# Altium schematic sheet Power_Embedded_Board_Top.SchDoc
size A; SheetNumber: 1; SheetTotal: 9
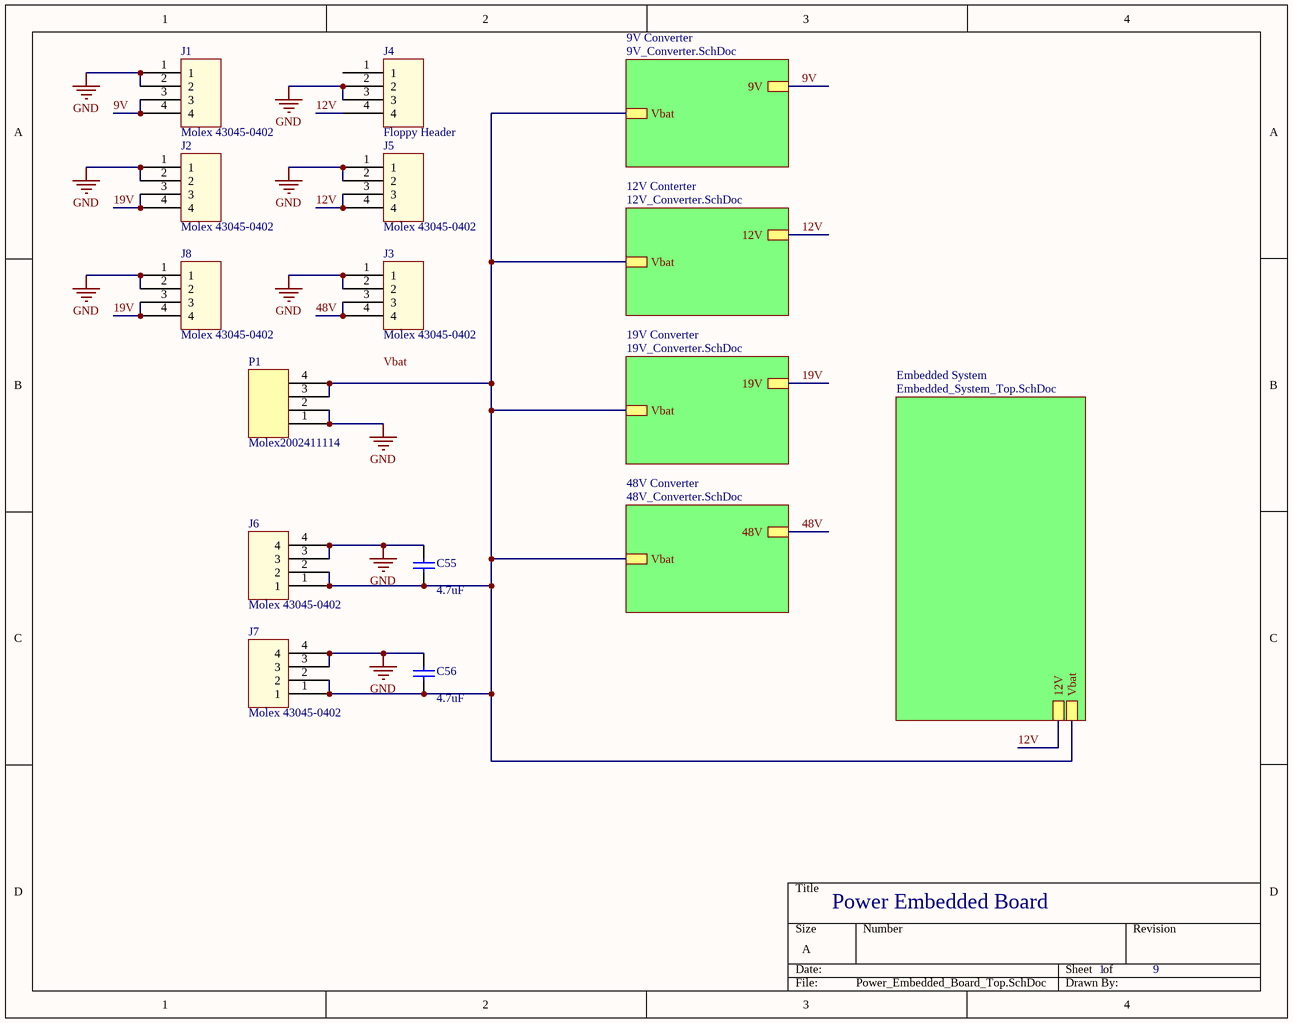
[diagram p0: Power_Embedded_Board_Top.SchDoc]

## Parts
C55  value 4.7uF  [C1210]  (hidden comment: HMK325C7475KN-TE)
C56  value 4.7uF  [C1210]  (hidden comment: HMK325C7475KN-TE)
J1  Molex 43045-0402  [Molex43045-0402]
J2  Molex 43045-0402  [Molex43045-0402]
J3  Molex 43045-0402  [Molex43045-0402]
J4  Floppy Header  [Header 1x4 12V]
J5  Molex 43045-0402  [Molex43045-0402]
J6  Molex 43045-0402  [Molex43045-0402]
J7  Molex 43045-0402  [Molex43045-0402]
J8  Molex 43045-0402  [Molex43045-0402]
P1  Molex2002411114  [Molex2002411114]

## Sub-sheets
9V Converter = 9V_Converter.SchDoc: Vbat, 9V
12V Conterter = 12V_Converter.SchDoc: Vbat, 12V
19V Converter = 19V_Converter.SchDoc: Vbat, 19V
48V Converter = 48V_Converter.SchDoc: Vbat, 48V
Embedded System = Embedded_System_Top.SchDoc: Vbat, 12V

## Nets
GND: C55.2 C56.2 J1.1 J1.2 J2.1 J2.2 J3.1 J3.2 J4.2 J4.3 J5.1 J5.2 J6.3 J6.4 J7.3 J7.4 J8.1 J8.2 P1.1 P1.2
9V: J1.3 J1.4 ; sheet 9V Converter/9V
12V: J4.4 J5.3 J5.4 ; sheet 12V Conterter/12V, sheet Embedded System/12V
19V: J2.3 J2.4 J8.3 J8.4 ; sheet 19V Converter/19V
48V: J3.3 J3.4 ; sheet 48V Converter/48V
NetC55_1: C55.1 C56.1 J6.1 J6.2 J7.1 J7.2 P1.3 P1.4 ; sheet 9V Converter/Vbat, sheet 12V Conterter/Vbat, sheet 19V Converter/Vbat, sheet 48V Converter/Vbat, sheet Embedded System/Vbat

Not connected (* = marked no-connect by the designer): J4 1

## Notes on the sheet
- Power Embedded Board
- Labels drawn without touching a wire or pin: Vbat

## Library data of the parts
C55 C56 = Cap Semi: Capacitor (Semiconductor SIM Model); Published: 8-Jun-2000; LatestRevisionDate: 29-May-2009; LatestRevisionNote: IPC-7351 Footprint Added.; PackageReference: C1206; Publisher: Altium Limited; PackageDescription: Chip Capacitor; ComponentLink1Description: Datasheet; ComponentLink1URL: https://www.yuden.co.jp/productdata/catalog/mlcc06_e.pdf; ComponentLink2Description: Digi-Key; ComponentLink2URL: https://www.digikey.com/product-detail/en/taiyo-yuden/HMK325C7475KN-TE/587-5038-1-ND/6563881
J1-J8 = Molex43045-0402: Micro-Fit 3.0 Right Angle Header, 3.00mm Pitch, Dual Row, 4 Circuits, with Snap-in Plastic Peg PCB Lock, Gold, Glow Wire Capable, Black; ComponentLink1Description: Molex Website; ComponentLink1URL: https://www.molex.com/molex/products/datasheet.jsp?part=active/0430450402_PCB_HEADERS.xml